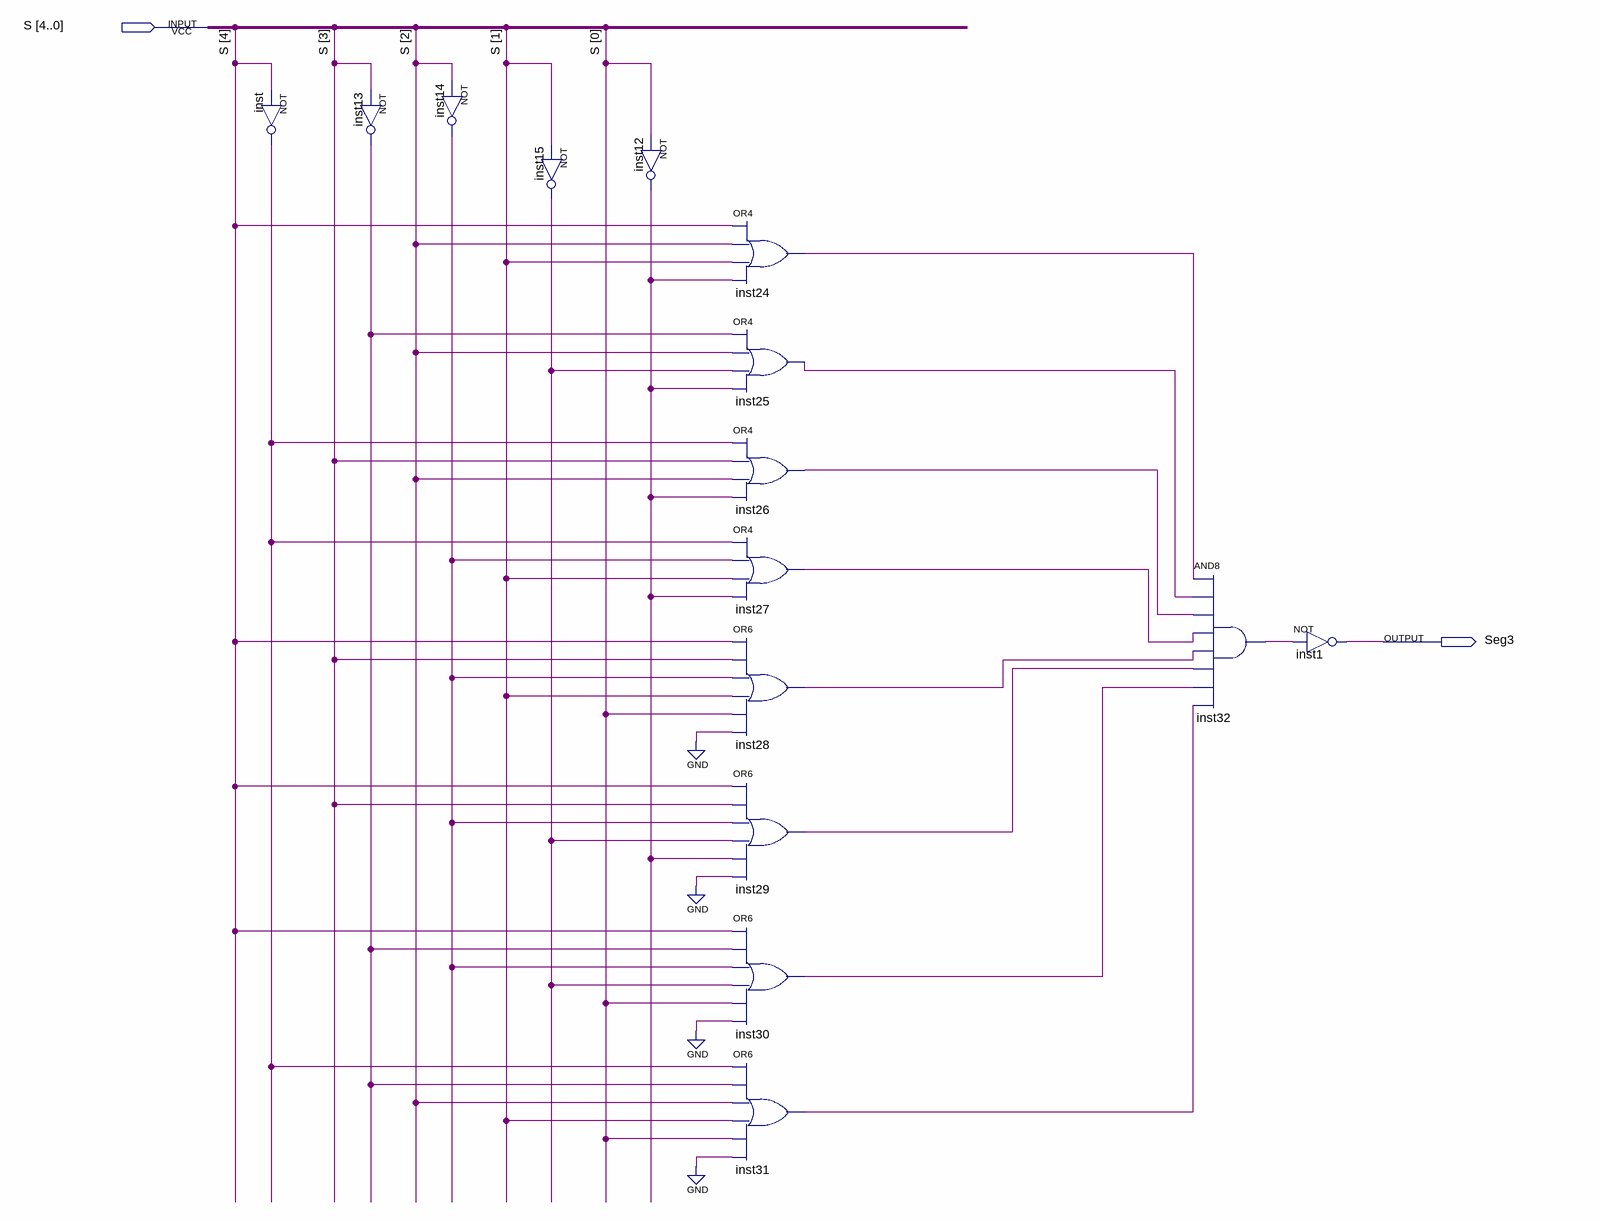
[diagram p0: schematic sheet]
// Quartus schematic Seg3.bdf as structural Verilog: 15 symbols, 2 pins
module Seg3 (
  input  [4:0] S,
  output Seg3
);

  wire inst12_out, inst13_out, inst14_out, inst15_out, inst24_out, inst25_out, inst26_out, inst27_out,
       inst28_out, inst29_out, inst30_out, inst31_out, inst32_out, inst_out;

  not inst (inst_out, S[4]);
  not inst13 (inst13_out, S[3]);
  not inst14 (inst14_out, S[2]);
  not inst15 (inst15_out, S[1]);
  not inst12 (inst12_out, S[0]);
  or inst24 (inst24_out, S[4], S[2], S[1], inst12_out);
  or inst25 (inst25_out, inst13_out, S[2], inst15_out, inst12_out);
  or inst26 (inst26_out, inst_out, S[3], S[2], inst12_out);
  or inst27 (inst27_out, inst_out, inst14_out, S[1], inst12_out);
  or inst28 (inst28_out, S[4], S[3], inst14_out, S[1], S[0], 1'b0);
  or inst29 (inst29_out, S[4], S[3], inst14_out, inst15_out, inst12_out, 1'b0);
  or inst30 (inst30_out, S[4], inst13_out, inst14_out, inst15_out, S[0], 1'b0);
  or inst31 (inst31_out, inst_out, inst13_out, S[2], S[1], S[0], 1'b0);
  and inst32 (inst32_out, inst24_out, inst25_out, inst26_out, inst27_out, inst28_out, inst29_out, inst30_out, inst31_out);
  not inst1 (Seg3, inst32_out);
endmodule
